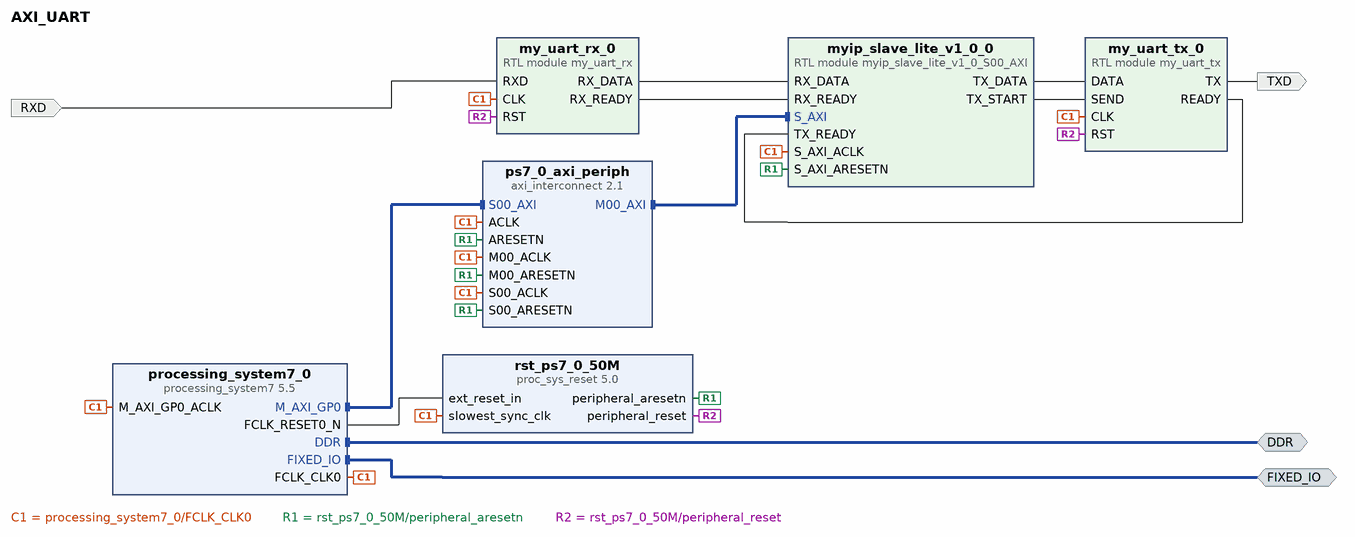
[diagram p0: block diagram of the top level]
# Vivado block design AXI_UART, xc7z007sclg400-1, Vivado 2024.1
create_bd_design AXI_UART

create_bd_intf_port -mode Master -vlnv xilinx.com:interface:ddrx_rtl:1.0 DDR
create_bd_intf_port -mode Master -vlnv xilinx.com:display_processing_system7:fixedio_rtl:1.0 FIXED_IO
create_bd_port -dir I RXD
create_bd_port -dir O TXD

create_bd_cell -type ip -vlnv xilinx.com:ip:processing_system7:5.5 processing_system7_0
set_property -dict [list \
  CONFIG.PCW_SD0_GRP_CD_ENABLE 0 \
  CONFIG.PCW_SD0_GRP_WP_ENABLE 0 \
  CONFIG.PCW_SD0_PERIPHERAL_ENABLE 1 \
  CONFIG.PCW_SD0_SD0_IO {MIO 40 .. 45} \
  CONFIG.PCW_SDIO_PERIPHERAL_FREQMHZ 100 \
  CONFIG.PCW_UART0_PERIPHERAL_ENABLE 1 \
  CONFIG.PCW_UART0_UART0_IO EMIO \
  CONFIG.PCW_UART_PERIPHERAL_FREQMHZ 100 \
] [get_bd_cells processing_system7_0]
# 57 more settings of processing_system7_0 are not shown: defaults, MIO pin electricals, DDR timing, and values the tool derives
create_bd_cell -type module -reference myip_slave_lite_v1_0_S00_AXI myip_slave_lite_v1_0_0
create_bd_cell -type ip -vlnv xilinx.com:ip:axi_interconnect:2.1 ps7_0_axi_periph
set_property -dict {CONFIG.NUM_MI 1} [get_bd_cells ps7_0_axi_periph]
create_bd_cell -type ip -vlnv xilinx.com:ip:proc_sys_reset:5.0 rst_ps7_0_50M
create_bd_cell -type module -reference my_uart_rx my_uart_rx_0
create_bd_cell -type module -reference my_uart_tx my_uart_tx_0

# ---- connections ----

connect_bd_intf_net [get_bd_intf_ports DDR] [get_bd_intf_pins processing_system7_0/DDR]
connect_bd_intf_net [get_bd_intf_ports FIXED_IO] [get_bd_intf_pins processing_system7_0/FIXED_IO]
connect_bd_intf_net [get_bd_intf_pins processing_system7_0/M_AXI_GP0] [get_bd_intf_pins ps7_0_axi_periph/S00_AXI]
connect_bd_intf_net [get_bd_intf_pins ps7_0_axi_periph/M00_AXI] [get_bd_intf_pins myip_slave_lite_v1_0_0/S_AXI]
connect_bd_net -net RXD_0_1 [get_bd_ports RXD] [get_bd_pins my_uart_rx_0/RXD]
connect_bd_net [get_bd_pins my_uart_rx_0/RX_DATA] [get_bd_pins myip_slave_lite_v1_0_0/RX_DATA]
connect_bd_net [get_bd_pins my_uart_rx_0/RX_READY] [get_bd_pins myip_slave_lite_v1_0_0/RX_READY]
connect_bd_net [get_bd_pins my_uart_tx_0/READY] [get_bd_pins myip_slave_lite_v1_0_0/TX_READY]
connect_bd_net [get_bd_pins my_uart_tx_0/TX] [get_bd_ports TXD]
connect_bd_net [get_bd_pins myip_slave_lite_v1_0_0/TX_DATA] [get_bd_pins my_uart_tx_0/DATA]
connect_bd_net [get_bd_pins myip_slave_lite_v1_0_0/TX_START] [get_bd_pins my_uart_tx_0/SEND]
connect_bd_net [get_bd_pins processing_system7_0/FCLK_CLK0] \
  [get_bd_pins processing_system7_0/M_AXI_GP0_ACLK] [get_bd_pins ps7_0_axi_periph/S00_ACLK] \
  [get_bd_pins rst_ps7_0_50M/slowest_sync_clk] [get_bd_pins myip_slave_lite_v1_0_0/S_AXI_ACLK] \
  [get_bd_pins ps7_0_axi_periph/M00_ACLK] [get_bd_pins ps7_0_axi_periph/ACLK] [get_bd_pins my_uart_tx_0/CLK] \
  [get_bd_pins my_uart_rx_0/CLK]
connect_bd_net [get_bd_pins processing_system7_0/FCLK_RESET0_N] [get_bd_pins rst_ps7_0_50M/ext_reset_in]
connect_bd_net [get_bd_pins rst_ps7_0_50M/peripheral_aresetn] \
  [get_bd_pins ps7_0_axi_periph/S00_ARESETN] [get_bd_pins myip_slave_lite_v1_0_0/S_AXI_ARESETN] \
  [get_bd_pins ps7_0_axi_periph/M00_ARESETN] [get_bd_pins ps7_0_axi_periph/ARESETN]
connect_bd_net [get_bd_pins rst_ps7_0_50M/peripheral_reset] [get_bd_pins my_uart_tx_0/RST] [get_bd_pins my_uart_rx_0/RST]

# ---- address map ----
assign_bd_address -offset 0x40000000 -range 4K -target_address_space [get_bd_addr_spaces processing_system7_0/Data] [get_bd_addr_segs myip_slave_lite_v1_0_0/S_AXI/reg0]

validate_bd_design
save_bd_design
